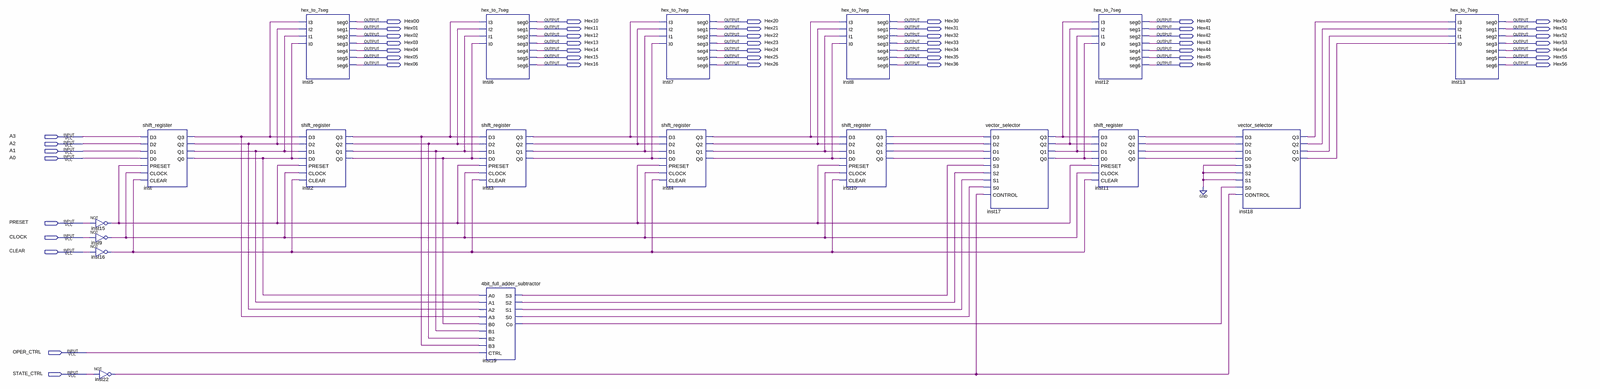
[diagram p0: schematic sheet, whole]
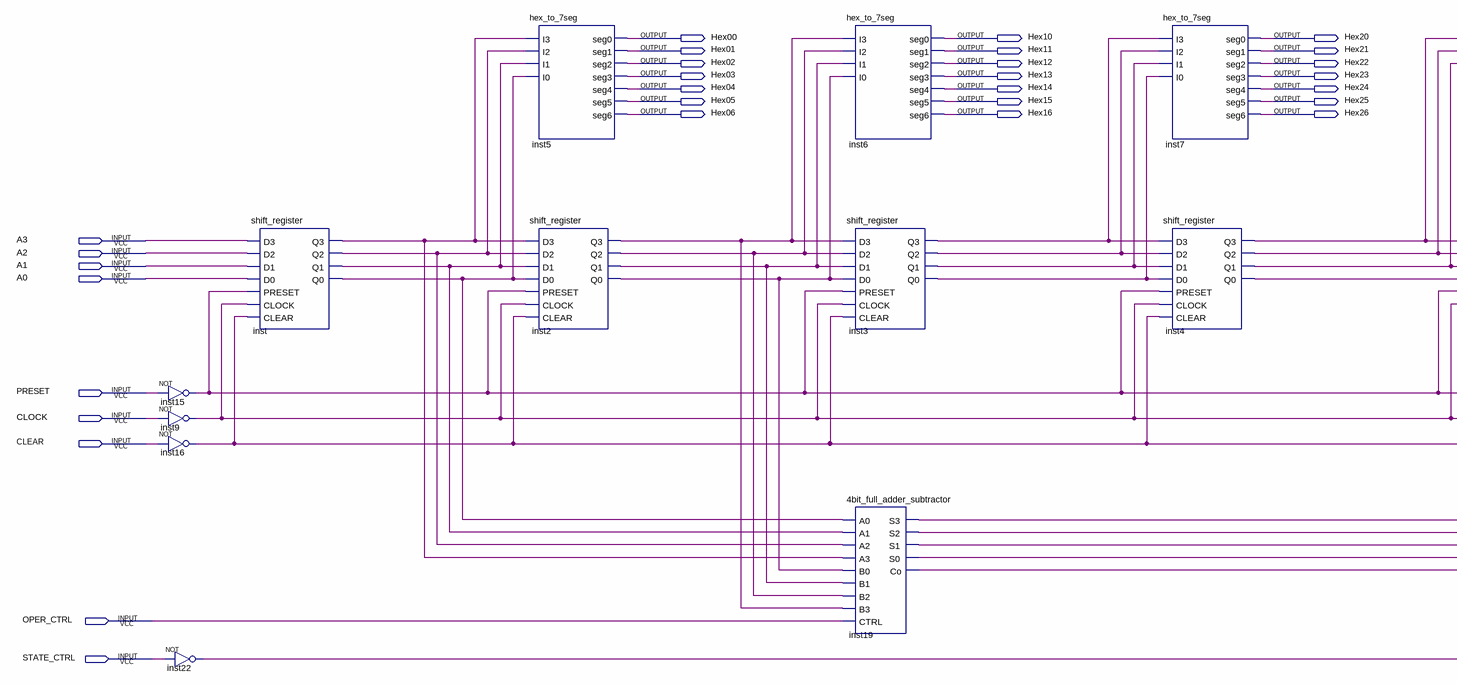
[diagram p1: schematic sheet, left part]
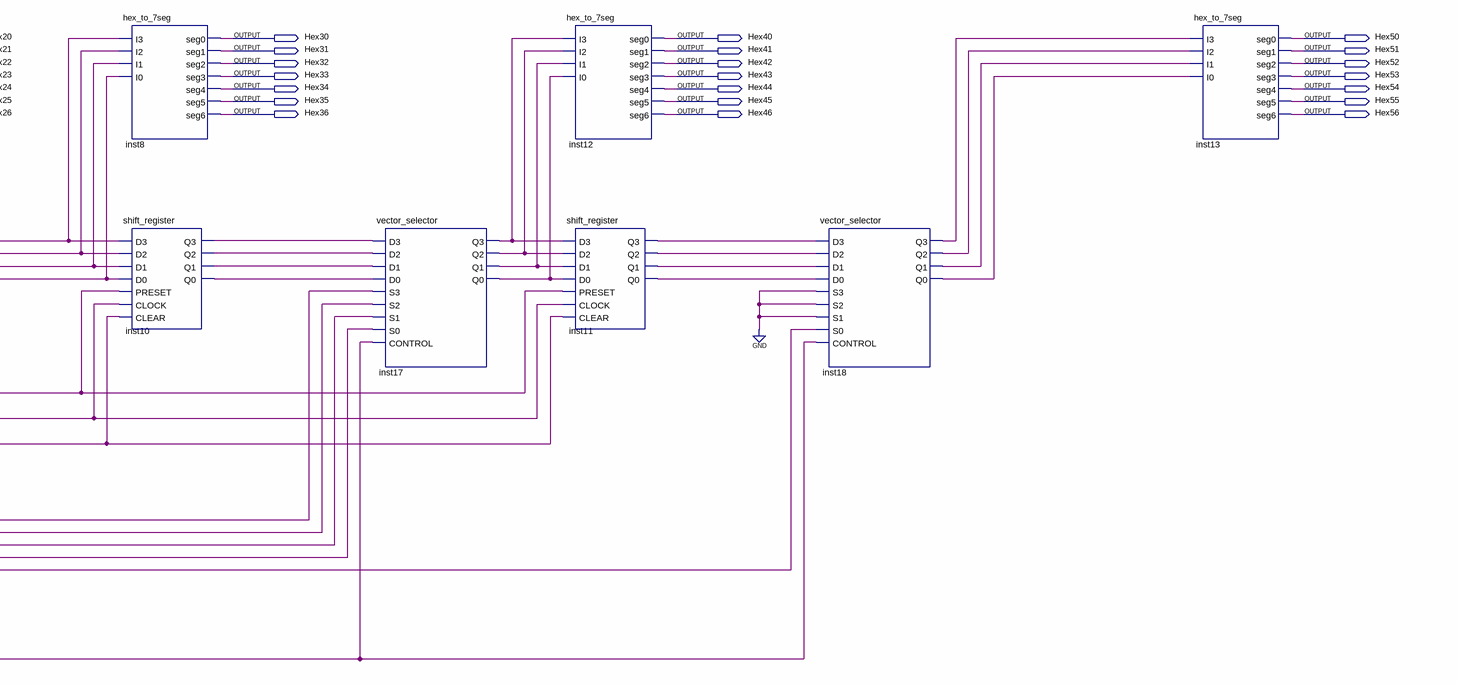
[diagram p2: schematic sheet, right part]
// Quartus schematic lab002_2.bdf as structural Verilog: 19 symbols, 51 pins
module lab002_2 (
  input  A3,
  input  A2,
  input  A1,
  input  A0,
  input  PRESET,
  input  CLOCK,
  input  CLEAR,
  input  OPER_CTRL,
  input  STATE_CTRL,
  output Hex00,
  output Hex10,
  output Hex20,
  output Hex30,
  output Hex40,
  output Hex50,
  output Hex01,
  output Hex11,
  output Hex21,
  output Hex31,
  output Hex41,
  output Hex51,
  output Hex02,
  output Hex12,
  output Hex22,
  output Hex32,
  output Hex42,
  output Hex52,
  output Hex03,
  output Hex13,
  output Hex23,
  output Hex33,
  output Hex43,
  output Hex53,
  output Hex04,
  output Hex14,
  output Hex24,
  output Hex34,
  output Hex44,
  output Hex54,
  output Hex05,
  output Hex15,
  output Hex25,
  output Hex35,
  output Hex45,
  output Hex55,
  output Hex06,
  output Hex16,
  output Hex26,
  output Hex36,
  output Hex46,
  output Hex56
);

  wire inst2_q0, inst2_q1, inst2_q2, inst2_q3, inst3_q0, inst3_q1, inst3_q2, inst3_q3, inst4_q0, inst4_q1,
       inst4_q2, inst4_q3, inst9_out, inst10_q0, inst10_q1, inst10_q2, inst10_q3, inst11_q0, inst11_q1,
       inst11_q2, inst11_q3, inst15_out, inst16_out, inst17_q0, inst17_q1, inst17_q2, inst17_q3, inst18_q0,
       inst18_q1, inst18_q2, inst18_q3, inst19_co, inst19_s0, inst19_s1, inst19_s2, inst19_s3, inst22_out,
       inst_q0, inst_q1, inst_q2, inst_q3;

  not inst15 (inst15_out, PRESET);
  not inst9 (inst9_out, CLOCK);
  not inst16 (inst16_out, CLEAR);
  not inst22 (inst22_out, STATE_CTRL);
  shift_register inst (
    .D3(A3), .D2(A2), .D1(A1), .D0(A0), .PRESET(inst15_out), .CLOCK(inst9_out), .CLEAR(inst16_out),
    .Q3(inst_q3), .Q2(inst_q2), .Q1(inst_q1), .Q0(inst_q0));
  hex_to_7seg inst5 (
    .I3(inst_q3), .I2(inst_q2), .I1(inst_q1), .I0(inst_q0), .seg0(Hex00), .seg1(Hex01), .seg2(Hex02),
    .seg3(Hex03), .seg4(Hex04), .seg5(Hex05), .seg6(Hex06));
  shift_register inst2 (
    .D3(inst_q3), .D2(inst_q2), .D1(inst_q1), .D0(inst_q0), .PRESET(inst15_out), .CLOCK(inst9_out),
    .CLEAR(inst16_out), .Q3(inst2_q3), .Q2(inst2_q2), .Q1(inst2_q1), .Q0(inst2_q0));
  hex_to_7seg inst6 (
    .I3(inst2_q3), .I2(inst2_q2), .I1(inst2_q1), .I0(inst2_q0), .seg0(Hex10), .seg1(Hex11), .seg2(Hex12),
    .seg3(Hex13), .seg4(Hex14), .seg5(Hex15), .seg6(Hex16));
  shift_register inst3 (
    .D3(inst2_q3), .D2(inst2_q2), .D1(inst2_q1), .D0(inst2_q0), .PRESET(inst15_out), .CLOCK(inst9_out),
    .CLEAR(inst16_out), .Q3(inst3_q3), .Q2(inst3_q2), .Q1(inst3_q1), .Q0(inst3_q0));
  \4bit_full_adder_subtractor  inst19 (
    .A0(inst_q0), .A1(inst_q1), .A2(inst_q2), .A3(inst_q3), .B0(inst2_q0), .B1(inst2_q1), .B2(inst2_q2),
    .B3(inst2_q3), .CTRL(OPER_CTRL), .S3(inst19_s3), .S2(inst19_s2), .S1(inst19_s1), .S0(inst19_s0),
    .Co(inst19_co));
  hex_to_7seg inst7 (
    .I3(inst3_q3), .I2(inst3_q2), .I1(inst3_q1), .I0(inst3_q0), .seg0(Hex20), .seg1(Hex21), .seg2(Hex22),
    .seg3(Hex23), .seg4(Hex24), .seg5(Hex25), .seg6(Hex26));
  shift_register inst4 (
    .D3(inst3_q3), .D2(inst3_q2), .D1(inst3_q1), .D0(inst3_q0), .PRESET(inst15_out), .CLOCK(inst9_out),
    .CLEAR(inst16_out), .Q3(inst4_q3), .Q2(inst4_q2), .Q1(inst4_q1), .Q0(inst4_q0));
  hex_to_7seg inst8 (
    .I3(inst4_q3), .I2(inst4_q2), .I1(inst4_q1), .I0(inst4_q0), .seg0(Hex30), .seg1(Hex31), .seg2(Hex32),
    .seg3(Hex33), .seg4(Hex34), .seg5(Hex35), .seg6(Hex36));
  shift_register inst10 (
    .D3(inst4_q3), .D2(inst4_q2), .D1(inst4_q1), .D0(inst4_q0), .PRESET(inst15_out), .CLOCK(inst9_out),
    .CLEAR(inst16_out), .Q3(inst10_q3), .Q2(inst10_q2), .Q1(inst10_q1), .Q0(inst10_q0));
  vector_selector inst17 (
    .D3(inst10_q3), .D2(inst10_q2), .D1(inst10_q1), .D0(inst10_q0), .S3(inst19_s3), .S2(inst19_s2),
    .S1(inst19_s1), .S0(inst19_s0), .CONTROL(inst22_out), .Q3(inst17_q3), .Q2(inst17_q2), .Q1(inst17_q1),
    .Q0(inst17_q0));
  hex_to_7seg inst12 (
    .I3(inst17_q3), .I2(inst17_q2), .I1(inst17_q1), .I0(inst17_q0), .seg0(Hex40), .seg1(Hex41), .seg2(Hex42),
    .seg3(Hex43), .seg4(Hex44), .seg5(Hex45), .seg6(Hex46));
  shift_register inst11 (
    .D3(inst17_q3), .D2(inst17_q2), .D1(inst17_q1), .D0(inst17_q0), .PRESET(inst15_out), .CLOCK(inst9_out),
    .CLEAR(inst16_out), .Q3(inst11_q3), .Q2(inst11_q2), .Q1(inst11_q1), .Q0(inst11_q0));
  vector_selector inst18 (
    .D3(inst11_q3), .D2(inst11_q2), .D1(inst11_q1), .D0(inst11_q0), .S3(1'b0), .S2(1'b0), .S1(1'b0),
    .S0(inst19_co), .CONTROL(inst22_out), .Q3(inst18_q3), .Q2(inst18_q2), .Q1(inst18_q1), .Q0(inst18_q0));
  hex_to_7seg inst13 (
    .I3(inst18_q3), .I2(inst18_q2), .I1(inst18_q1), .I0(inst18_q0), .seg0(Hex50), .seg1(Hex51), .seg2(Hex52),
    .seg3(Hex53), .seg4(Hex54), .seg5(Hex55), .seg6(Hex56));
endmodule
